# Altium project BreadboardCompanion.PrjPcb
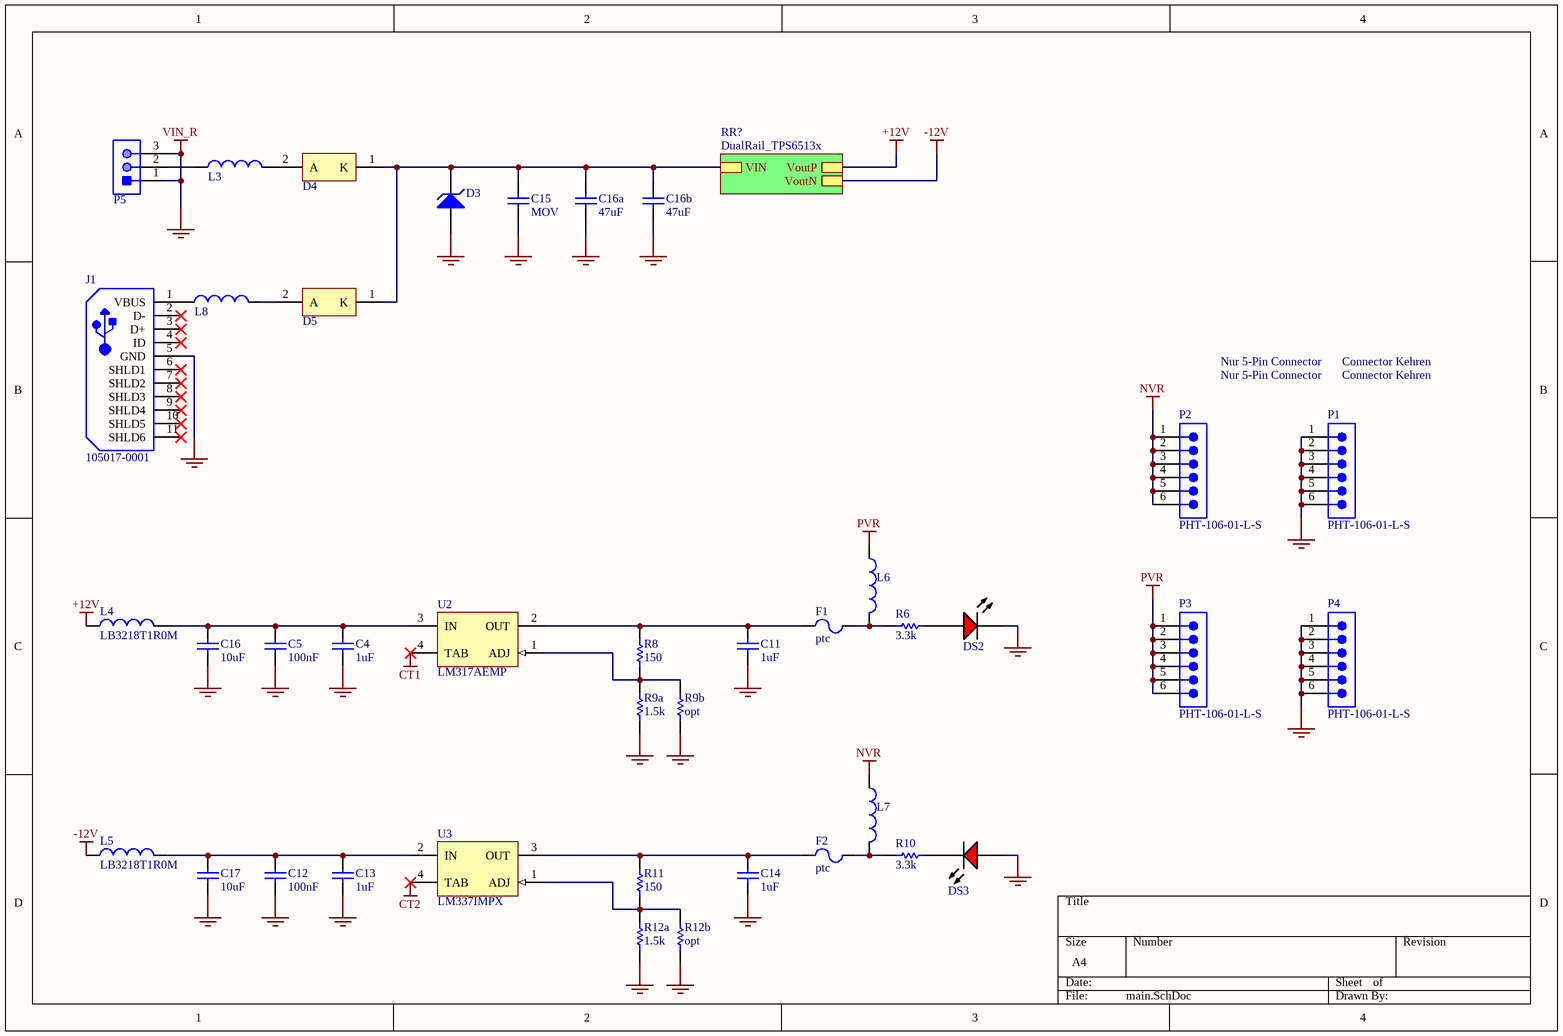
[diagram p0: main.SchDoc]
2 sheets, 68 parts. Net scope: hierarchical (ports join the sheet entries above them; power ports are global).
Board file: breadboardPlugin.PcbDoc
Sheets:
  main.SchDoc
    RR? = DualRail_TPS6513x.SchDoc

## Sheet main.SchDoc
size A4

### Parts
C4  1uF  [CAPC0603(1608)100_L]
C5  100nF  [CAPC0603(1608)100_L]
C11  1uF  [CAPC0603(1608)100_L]
C12  100nF  [CAPC0603(1608)100_L]
C13  1uF  [CAPC0603(1608)100_L]
C14  1uF  [CAPC0603(1608)100_L]
C15  MOV  [CAPC0805(2012)75_L]
C16  10uF  [CAPC1206(3216)190_L]
C16a  47uF  [CAPC1206(3216)190_L]
C16b  47uF  [CAPC1206(3216)190_L]
C17  10uF  [CAPC1206(3216)190_L]
D3  Q6 - btz52c5v6  [DIOD-SOD123-2_V]  (value not drawn)
D4  MBRM120LT3  [ONSC-POWERMITE-2-457-04_D_V]  (value not drawn)
D5  MBRM120LT3  [ONSC-POWERMITE-2-457-04_D_V]  (value not drawn)
DS2  TLMS1100-GS08  [VISH-TLMX1100_V]  (value not drawn)
DS3  TLMS1100-GS08  [VISH-TLMX1100_V]  (value not drawn)
F1  ptc  [LFUS-1206L012WR_V]
F2  ptc  [LFUS-1206L012WR_V]
J1  105017-0001  [USB-MICRO-B_V]
L3  FBMJ2125HM210NT  [INDC2013X105X50LL20T30]  (value not drawn)
L4  LB3218T1R0M  [TDK-B82422A1103K100_V]
L5  LB3218T1R0M  [TDK-B82422A1103K100_V]
L6  FBMJ2125HM210NT  [INDC2013X105X50LL20T30]  (value not drawn)
L7  FBMJ2125HM210NT  [INDC2013X105X50LL20T30]  (value not drawn)
L8  FBMJ2125HM210NT  [INDC2013X105X50LL20T30]  (value not drawn)
P1  PHT-106-01-L-S  [SMTC-PHT-106-01-X-S]
P2  PHT-106-01-L-S  [SMTC-PHT-106-01-X-S]
P3  PHT-106-01-L-S  [SMTC-PHT-106-01-X-S]
P4  PHT-106-01-L-S  [SMTC-PHT-106-01-X-S]
P5  22-23-2031  [MOLX-22-23-2031_V]  (value not drawn)
R6  3.3k  [RESC0603(1608)_L]
R8  150  [RESC0603(1608)_L]
R9a  1.5k  [RESC0603(1608)_L]
R9b  opt  [RESC0603(1608)_L]
R10  3.3k  [RESC0603(1608)_L]
R11  150  [RESC0603(1608)_L]
R12a  1.5k  [RESC0603(1608)_L]
R12b  opt  [RESC0603(1608)_L]
U2  LM317AEMP  [DCY0004A_N]
U3  LM337IMPX  [MP04A_N]

### Sub-sheets
RR? = DualRail_TPS6513x: VoutP, VoutN, VIN

### Nets
+12V: L4.1 ; sheet RR?/VoutP
-12V: L5.1 ; sheet RR?/VoutN
CT1: U2.4(TAB)
CT2: U3.4(TAB)
GND: C4.1 C5.1 C11.1 C12.1 C13.1 C14.1 C15.1 C16.1 C16a.1 C16b.1 C17.1 D3.1(A) DS2.2(K) DS3.1(A) J1.5(GND) P1.1 P1.2 P1.3 P1.4 P1.5 P1.6 P4.1 P4.2 P4.3 P4.4 P4.5 P4.6 P5.1 P5.3 R9a.2 R9b.2 R12a.2 R12b.2  [also labelled VIN_R]
NVR: L7.1 P2.1 P2.2 P2.3 P2.4 P2.5 P2.6
PVR: L6.1 P3.1 P3.2 P3.3 P3.4 P3.5 P3.6
NetC1_2: C15.2 C16a.2 C16b.2 D3.2(K) D4.1(K) D5.1(K) ; sheet RR?/VIN
NetC4_2: C4.2 C5.2 C16.2 L4.2 U2.3(IN)
NetC11_2: C11.2 F1.1 R8.1 U2.2(OUT)
NetC12_2: C12.2 C13.2 C17.2 L5.2 U3.2(IN)
NetC14_2: C14.2 F2.1 R11.1 U3.3(OUT)
NetD4_2: D4.2(A) L3.2
NetD5_2: D5.2(A) L8.2
NetDS2_1: DS2.1(A) R6.2
NetDS3_2: DS3.2(K) R10.2
NetF1_2: F1.2 L6.2 R6.1
NetF2_2: F2.2 L7.2 R10.1
NetJ1_1: J1.1(VBUS) L8.1
NetL3_1: L3.1 P5.2
NetR8_2: R8.2 R9a.1 R9b.1 U2.1(ADJ)
NetR11_2: R11.2 R12a.1 R12b.1 U3.1(ADJ)

Not connected (* = marked no-connect by the designer): J1 2(D-)* 3(D+)* 4(ID)* 6(SHLD1)* 7(SHLD2)* 8(SHLD3)* 9(SHLD4)* 10(SHLD5)* 11(SHLD6)*

### Notes on the sheet
- Nur 5-Pin Connector
- Connector Kehren

### Library data of the parts
C4 C11 C13 C14 = CMP-1035-02589-1: CAP 1uF 25V ±20% 0603 (1608 Metric) Thickness 1mm SMD; Value: 100nF; Case-EIA: 0603; Tolerance: Â±20%; Case-Metric: 1608; Max Thickness: 1 mm; Technology: SMT; Rated Voltage: 25 V
C5 C12 = CMP-1035-02589-1: CAP 100nF 25V ±20% 0603 (1608 Metric) Thickness 1mm SMD; Case-EIA: 0603; Tolerance: Â±20%; Case-Metric: 1608; Value: 100nF; Max Thickness: 1 mm; Technology: SMT; Rated Voltage: 25 V
C15 = CMP-1036-03595-1: MOV 0805; Case-EIA: 0805; Value: 4.7nF; Rated Voltage: 50 V; Case-Metric: 2012; Tolerance: Â±20%; Technology: SMT; Max Thickness: 0.75 mm
C16 C17 = CMP-1037-04919-1: CAP 4.7uF 25V ±20% 1206 (3216 Metric) Thickness 1.9mm SMD; Tolerance: Â±20%; Case-Metric: 3216; Case-EIA: 1206; Max Thickness: 1.9 mm; Value: 4.7uF; Technology: SMT; Rated Voltage: 25 V
C16a C16b = CMP-1037-04919-1: CAP 47uF 10V ±20% 1206 X5R; Tolerance: Â±20%; Case-Metric: 3216; Value: 4.7uF; Rated Voltage: 25 V; Case-EIA: 1206; Max Thickness: 1.9 mm; Technology: SMT
D3 = CMP-0860-00001-1: Zener Diode 500mw, 5.6v; Manufacturer: Diodes Inc; PartNumber: BZT52C16-7-F; Maximum Reverse Current: 0.1 uA; Tol V: 5.56% Typ.; Maximum Zener Impedance f: 1 kHz ZZK=200 Ohm; Voltage Zener: 16 V Typ.; Packing: Tape and Reel; ComponentLink2URL: http://www.diodes.com/datasheets/ds18004.pdf; PackageDescription: 2-Pin SOD123, Body 2.7 x 1.55 mm, Height 1.45 mm; ComponentLink3Description: Package Specification; Mounting Technology: Surface Mount; PackageReference: SOD123; ComponentLink2Description: Datasheet; RoHS: TRUE; ComponentLink3URL: http://www.diodes.com/datasheets/ap02002.pdf; Operating Temperature: -65 to 150 degC; DatasheetVersion: Rev. 37-2; ComponentLink1Description: Manufacturer URL; ComponentLink1URL: http://www.diodes.com/; PackageVersion: Rev. 79; Power Max: 500 mW
D4 D5 = CMP-1055-00282-1: Schottky Power Rectifier, 2-Pin Powermite, Tape and Reel; Manufacturer: On Semiconductor; Note1: 0; IFSM Max (A): 50; Configuration: Single; Mounting Technology: Surface Mount; PackageReference: POWERMITE-2-457-04; PackageDescription: 2-Pin POWERMITE, Body 1.965 x 1.9 mm; PackageVersion: Rev. F, 05/2013; RoHS: FALSE; DatasheetVersion: Rev. 7; ComponentLink3URL: http://www.onsemi.com/pub_link/Collateral/457-04.PDF; ComponentLink2Description: Datasheet; ComponentLink3Description: Package Specification; ComponentLink1URL: http://www.onsemi.com/; ComponentLink1Description: Manufacturer URL; ComponentLink2URL: http://www.onsemi.cn/pub_link/Collateral/MBRM120L-D.PDF; PartNumber: MBRM120LT3; Packing: Tape and Reel
DS2 DS3 = CMP-1666-00027-1: LED, RED, 2.1 V, -40 to 100 degC, 2-Pin SMD (0603), RoHS, Tape and Reel; Type (Capacitors): C0G; Resistance: 100000000000 Ohm; Capacitance: 12 pF; Voltage Rating: 50 V; Tolerance: 5%; Min Operating Temperature: -55degC; REACH SVHC: No SVHC; ComponentLink2Description: Datasheet; ComponentLink1URL: http://www.vishay.com/; Width: 0.8 mm; Package Quantity: 4000; PackageReference: TLMX1100; ComponentLink2URL: http://www.vishay.com/docs/83173/tlmb1100.pdf; Case/Package: 0603; Case Code (Metric): 1608; Packaging: Tape and Reel; Pins: 2; ComponentLink1Description: Manufacturer URL; Max Operating Temperature: 125degC; Height: 0.8 mm; Length: 1.6 mm; Mount: Surface Mount; PackageDescription: 2-Pin Surface Mount Device, Body 1.6 x 0.8 mm; DatasheetVersion: Rev. 2.7, 03/2016; Case Code (Imperial): 0603; Voltage Rating (DC): 50 V; RoHSCompliant: True; Radiation Hardening: No
F1 F2 = CMP-2000-05470-1: 200mA PTC; Manufacturer: Littelfuse; Hold Current [Ih]: 0.125A; Working Voltage-Max: 30V; Trip Current: 0.29A; Operating Temp Range: -40to+85°C; Package Reference: 1206; Package Description: 2-Pin Surface Mount Device, Body 3.2 x 1.65 mm; Mounting Technology: SurfaceMount; Manufacturer URL: http://www.littelfuse.com/; Datasheet URL: https://datasheet.ciiva.com/26787/1206l012wr-26787215.pdf; Size: 1206; Datasheet Version: 04/2012
J1 = CMP-2000-05827-1: Micro-USB B Receptacle, Right Angle, Bottom Mount, Surface Mount, with Solder Tabs, -30 to 85 degC, 5-Pin USB, RoHS, Tape and Reel; Manufacturer: Molex; Featured Product: Micro-USBConnectorsUSBConnectors; Other Names: WM1399DKR; Package Version: Rev. F, 12/2012; Number of Contacts: 5; Connector Type: USB-microB; Catalog Drawings: 1050170001; 3D Model: 105017-0001.stp; Mating Products: WM17145-ND-CABLEMICROUSBBTOSTDA1.0MWM17147-ND-CABLEMICROUSBBTOSTDA2.0MWM17146-ND-CABLEMICROUSBBTOSTDA1.5M; PCN Assembly/Origin: ResinSupplier21/Oct/2015; Voltage - Max: 30V; Online Catalog: Molex-MicroUSB; Manufacturer URL: http://www.molex.com/; Package Description: 5-Leads USB, Micro B, Body 7.5 x 5 mm, Pitch 0.65 mm; Datasheet URL: http://www.molex.com/elqNow/elqRedir.htm?ref=http://www.molex.com/webdocs/datasheets/pdf/en-us/1050170001_IO_CONNECTORS.pdf; Ingress Protection: -; Datasheet Version: 03/2016; Mounting Type: BoardCutout,SurfaceMount,RightAngle; Circuits: 5; Standard Package: 1; Package Reference: MICRO-B; Package URL: http://www.molex.com/pdm_docs/sd/1050170001_sd.pdf; Category: Connectors,Interconnects; Series: -; RoHS Information: 1050170001CertofCompliance; Features: Shielded,SolderRetention; Family: USB,DVI,HDMIConnectors; Specifications: -; Gender: Receptacle; Packaging: Digi-Reel®; Mounting Technology: SurfaceMount
L3 L6-L8 = CMP-1660-00003-1: Chip Inductor, 21 Ohm, +/- 30%, 6 A, -40 to 125 degC, 0805 (2012 Metric), RoHS, Tape and Reel; Core Material: Ferrite; Current Rating: 6 A; Resistance: 4 mohm; Case\Package: 0805; Impedance: 21 Ohm; Min Operating Temperature: -40 degC; Width: 1.25 mm; PackageDescription: 2-Pin Surface Mount Device, Body 2 x 1.25 mm; Mounting Technology: Surface Mount; Package Quantity: 1; DatasheetVersion: 08/2016; Tolerance: 30%; Mount: Surface Mount; Max Operating Temperature: 125 degC; Height: 0.85 mm; ComponentLink1URL: http://www.t-yuden.com/; Case Code (Metric): 2012; ComponentLink1Description: Manufacturer URL; ComponentLink2URL: http://ds.yuden.co.jp/TYCOMPAS/ut/detail.do?productNo=FBMJ2125HM210NT&fileName=FBMJ2125HM210NT_SS&mode=specSheetDownload; Case Code (Imperial): 0805; Packaging: Tape and Reel; ComponentLink2Description: Datasheet; PackageReference: 0805; RoHSCompliant: true; Max Current Rating: 6 A; Length: 2 mm; REACH SVHC: Unknown
L4 L5 = CMP-2000-05912-1: FIXED IND 1UH 1.075A 60 MOHM SMD; Manufacturer: EPCOS-(TDK); Frequency - Test: 1MHz; Current Rating: 180mA; Material - Core: Ferrite; Inductance: 10µH; Tolerance: ±10%; DC Resistance (DCR): 1.6OhmMax; Type: Wirewound; Q @ Freq: 27@2.52MHz; Frequency - Self Resonant: 25MHz; Shielding: Unshielded; Series: SIMID; Mounting Type: SurfaceMount; Current - Saturation: -; Operating Temperature: -; Datasheet URL: https://en.tdk.eu/inf/30/db/ind_2008/b82422a_100.pdf; Ratings: AEC-Q200; Category: Inductors,Coils,Chokes; Mounting Technology: SurfaceMount; Family: FixedInductors; Package / Case: 1210(3225Metric); Manufacturer URL: http://www.tdk.com/; Datasheet Version: 10/2012; Packaging: CutTape(CT); Package Description: 2-Pin Surface Mount Device, Body 3.2 x 2.5 mm; Package Reference: B82422A1103K100
P1-P4 = CMP-1024-00187-1: Press Fit Header, Through-hole, Vertical, -55 to 125 degC, 2.54 mm Pitch, 6-Pin, Male, RoHS; Manufacturer: Samtec; Pitch: 2.54 mm; PackageReference: PHT-106-01-X-S; PackageDescription: .100 Press Fit Socket Assembly; ComponentLink3URL: http://www.samtec.com/documents/webfiles/cpdf/PHT-1XX-XX-X-X-XXX-MKT.pdf; PackageVersion: J, 9/2009; ComponentLink3Description: Package Specification; PartNumber: PHT-106-01-L-S; ComponentLink1Description: Manufacturer URL; Orientation: Vertical; Mounting Technology: Through-hole; ComponentLink1URL: http://www.samtec.com; ComponentLink2URL: http://www.samtec.com/documents/webfiles/pdf/pht.pdf; Temperature Range: -55 to 125 degC; RoHS: True; DatasheetVersion: F-214; ComponentLink2Description: Datasheet
P5 = CMP-2000-05242-1: Male Header, Pitch 2.54 mm, 1 x 3 Position, Height 8.18 mm, Tail Length 3.56 mm, RoHS, Bulk; Current Rating: 4A; Brand: Molex; Pitch: 2.54mm; Voltage Rating: 250V; Mounting Angle: Vertical; Type: Locking; Factory Pack Quantity: 16000; Tradename: KK; Housing Material: Nylon; Contact Material: Brass; Manufacturer URL: http://www.molex.com/; Termination Style: ThroughHole; Mounting Style: ThroughHole; Number of Positions: 3Position; Contact Gender: Pin(Male); Packaging: Bulk; Series: 6373; Datasheet Version: Sep-01; Contact Plating: Tin; Product: Headers; Datasheet URL: https://datasheet.ciiva.com/19472/232274-19472863.pdf; RoHS: Details; Product Category: Headers&WireHousings; Manufacturer: Molex; Number of Rows: 1Row
R6 R8 R9a R9b R10 R11 R12a R12b = CMP-1012-00397-1: Value: 100.00 Ohm; Case-EIA: 0603; Tolerance: 1 %; Power: 0.1 W; Case-Metric: 1608; Technology: SMT
U2 = CMP-0062-01709-3: 3-Terminal Adjustable Regulator, 4-pin SOT-223; Manufacturer: Texas Instruments; PowerWise: N; CompType: LDO IC; PackageTopMarking: XYTT*N07A; Code_JEDEC: TO-261-AA; PackageReference: DCY0004A; ComponentLink1URL: http://www.ti.com/general/docs/lit/getliterature.tsp?genericPartNumber=LM317-N&fileType=pdf; Code_IPC: SOT223-4; PinCount: 4; ComponentLink1Description: Datasheet URL; PackageDescription: Molded SOT-223, 6.50 x 3.56 x 1.6mm Body, 4 Lead, 2.3mm Pitch; RoHS: N
U3 = CMP-0062-01833-1: 3-Terminal Adjustable Negative Regulator, 4-pin SOT-223; Manufacturer: National Semiconductor; PackageTopMarking: XYTT*N02A; PowerWise: N; CompType: LDO IC; PinCount: 4; PackageDescription: Molded SOT-223, 6.50 x 3.56 x 1.6mm Body, 4 Lead, 2.3mm Pitch; DatasheetVersion: Nov-2004; Code_JEDEC: TO-261-AA; PackageVersion: revB, Apr-2003; PackageReference: MP04A; Code_IPC: SOT223-4; RoHS: N

## Sheet DualRail_TPS6513x.SchDoc
size A4
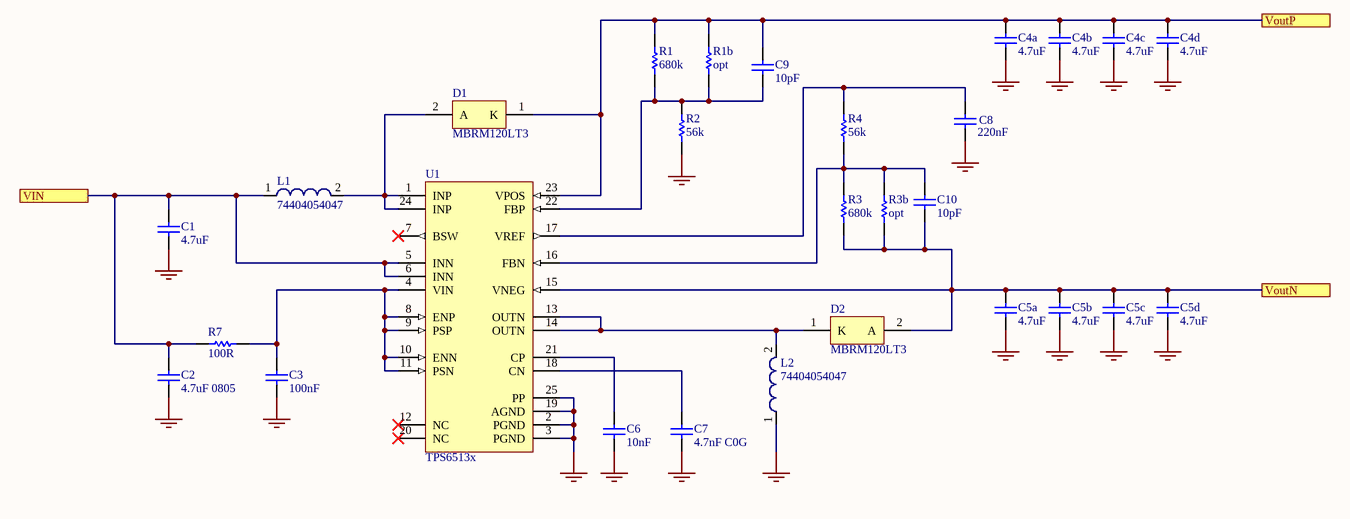
[diagram p1: DualRail_TPS6513x.SchDoc]

### Parts
C1  4.7uF  [CAPC1206(3216)190_L]
C2  4.7uF 0805  [CAPC0805(2012)155_N]
C3  100nF  [CAPC0603(1608)100_L]
C4a  4.7uF  [CAPC1206(3216)190_L]
C4b  4.7uF  [CAPC1206(3216)190_L]
C4c  4.7uF  [CAPC1206(3216)190_L]
C4d  4.7uF  [CAPC1206(3216)190_L]
C5a  4.7uF  [CAPC1206(3216)190_L]
C5b  4.7uF  [CAPC1206(3216)190_L]
C5c  4.7uF  [CAPC1206(3216)190_L]
C5d  4.7uF  [CAPC1206(3216)190_L]
C6  10nF  [CAPC0603(1608)100_L]
C7  4.7nF C0G  [CAPC0805(2012)75_L]
C8  220nF  [CAPC0603(1608)100_L]
C9  10pF  [CAPC0603(1608)100_L]
C10  10pF  [CAPC0603(1608)100_L]
D1  MBRM120LT3  [ONSC-POWERMITE-2-457-04_D_V]
D2  MBRM120LT3  [ONSC-POWERMITE-2-457-04_D_V]
L1  74404054047  [WE-LQS 5040]
L2  74404054047  [WE-LQS 5040]
R1  680k  [RESC0603(1608)_L]
R1b  opt  [RESC0603(1608)_L]
R2  56k  [RESC0603(1608)_L]
R3  680k  [RESC0603(1608)_L]
R3b  opt  [RESC0603(1608)_L]
R4  56k  [RESC0603(1608)_L]
R7  100R  [RESC0603(1608)_L]
U1  TPS6513x  [TI-RGE24-2450X2450TP_V]

### Ports
VIN, VoutN, VoutP

### Nets
+12V: C4a.2 C4b.2 C4c.2 C4d.2 C9.2 D1.1(K) R1.1 R1b.1 U1.23(VPOS) ; port VoutP
-12V: C5a.2 C5b.2 C5c.2 C5d.2 C10.2 D2.2(A) R3.2 R3b.2 U1.15(VNEG) ; port VoutN
GND: C1.1 C2.1 C3.1 C4a.1 C4b.1 C4c.1 C4d.1 C5a.1 C5b.1 C5c.1 C5d.1 C6.1 C7.1 C8.1 L2.1 R2.2 U1.2(PGND) U1.3(PGND) U1.19(AGND) U1.25(PP)
NetC1_2: C1.2 C2.2 L1.1 R7.2 U1.5(INN) U1.6(INN) ; port VIN
NetC3_2: C3.2 R7.1 U1.4(VIN) U1.8(ENP) U1.9(PSP) U1.10(ENN) U1.11(PSN)
NetC6_2: C6.2 U1.21(CP)
NetC7_2: C7.2 U1.18(CN)
NetC8_2: C8.2 R4.1 U1.17(VREF)
NetC9_1: C9.1 R1.2 R1b.2 R2.1 U1.22(FBP)
NetC10_1: C10.1 R3.1 R3b.1 R4.2 U1.16(FBN)
NetD1_2: D1.2(A) L1.2 U1.1(INP) U1.24(INP)
NetD2_1: D2.1(K) L2.2 U1.13(OUTN) U1.14(OUTN)

Not connected (* = marked no-connect by the designer): U1 7(BSW)* 12(NC)* 20(NC)*

### Library data of the parts
C1 C4a C4b C4c C4d C5a C5b C5c C5d = CMP-1037-04919-1: as C16 on sheet main; Max Thickness: 1.9 mm; Value: 4.7uF; Technology: SMT; Rated Voltage: 25 V
C2 = CMP-1036-04882-1: CAP 4.7uF 10V ±10% 0805 (2012 Metric) Thickness 1.55mm SMD; Case-EIA: 0805; Tolerance: Â±10%; Case-Metric: 2012; Rated Voltage: 10 V; Max Thickness: 1.55 mm; Technology: SMT; Value: 4.7uF
C3 C6 = CMP-1035-02589-1: as C5 on sheet main; Value: 100nF; Max Thickness: 1 mm; Technology: SMT; Rated Voltage: 25 V
C7 = CMP-1036-03595-1: CAP 4.7nF 50V ±20% 0805 (2012 Metric) Thickness 0.75mm SMD; Case-EIA: 0805; Case-Metric: 2012; Tolerance: Â±20%; Technology: SMT; Value: 4.7nF; Rated Voltage: 50 V; Max Thickness: 0.75 mm
C8 = CMP-1035-02639-1: CAP 220nF 10V ±5% 0603 (1608 Metric) Thickness 1mm SMD; Case-EIA: 0603; Tolerance: Â±5%; Case-Metric: 1608; Value: 220nF; Max Thickness: 1 mm; Technology: SMT; Rated Voltage: 10 V
C9 C10 = CMP-1035-02639-1: Case-EIA: 0603; Value: 220nF; Tolerance: Â±5%; Case-Metric: 1608; Rated Voltage: 10 V; Max Thickness: 1 mm; Technology: SMT
D1 D2 = CMP-1055-00282-1: as D4 on sheet main; Mounting Technology: Surface Mount; PackageReference: POWERMITE-2-457-04; PackageDescription: 2-Pin POWERMITE, Body 1.965 x 1.9 mm; PackageVersion: Rev. F, 05/2013; RoHS: FALSE; DatasheetVersion: Rev. 7; ComponentLink3URL: http://www.onsemi.com/pub_link/Collateral/457-04.PDF; ComponentLink2Description: Datasheet; ComponentLink3Description: Package Specification; ComponentLink1URL: http://www.onsemi.com/; ComponentLink1Description: Manufacturer URL; ComponentLink2URL: http://www.onsemi.cn/pub_link/Collateral/MBRM120L-D.PDF; PartNumber: MBRM120LT3; Packing: Tape and Reel
L1 L2 = CMP-1354-00047-1: WE-LQS SMD Power Inductor, L=4.7 µH; Manufacturer: Wuerth Elektronik; Inductance: 4.7 ÂµH; ComponentLink2Description: Datasheet; PackageReference: WE-LQS 5040; ComponentLink1URL: http://www.we-online.com; PartNumber: 74404054047; ComponentLink1Description: Manufacturer URL; ComponentLink2URL: http://katalog.we-online.de/pbs/datasheet/74404054047.pdf
R1 R1b R2 R3 R3b R4 = CMP-1012-00397-1: as R6 on sheet main; Technology: SMT
R7 = CMP-1012-00397-1: 100R 0.1W 1% 0603 (1608 Metric)  SMD; Value: 100.00 Ohm; Case-EIA: 0603; Case-Metric: 1608; Technology: SMT; Tolerance: 1 %; Power: 0.1 W
U1 = CMP-0388-00544-1: TPS65130 or TPS65131 Postive and Negative Output DC-DC Converter; PartNumber: TPS65130RGET; Manufacturer: Texas Instruments; SubFamily: LCD/OLED Display Bias Solutions; Rating: Catalog; Iq(Typ)(mA): 0.5; Topology: Boost, Inverting Buck/Boost; Vin(Min)(V): 2.7; Eco-Plan: Green (RoHS & no Sb/Br); Switching Frequency(Typ)(kHz): 1400; Vin(Max)(V): 5.5; Code_JEDEC: MO-220; ComponentLink1Description: Manufacturer URL; ComponentLink3Description: Package Specification; PackageReference: RGE24-2450X2450TP; ComponentLink3URL: http://www.ti.com/litv/pdf/mpqf124f; PackageVersion: 4204104/G; ComponentLink2URL: http://www.ti.com/general/docs/lit/getliterature.tsp?genericPartNumber=TPS65130&fileType=pdf; ComponentLink2Description: Datasheet; DatasheetVersion: SLVS493B; ComponentLink1URL: http://www.ti.com/; PackageDescription: 24-Pin Plastic Flat Pack, Body 4 x 4 mm, 0.5 mm Pitch; Mounting Technology: Surface Mount

## Nets that join several sheets
+12V: main (L4.1), DualRail_TPS6513x (9 pins)
-12V: main (L5.1), DualRail_TPS6513x (9 pins)
GND: main (33 pins), DualRail_TPS6513x (20 pins)
NetC1_2: main (6 pins), DualRail_TPS6513x (6 pins)